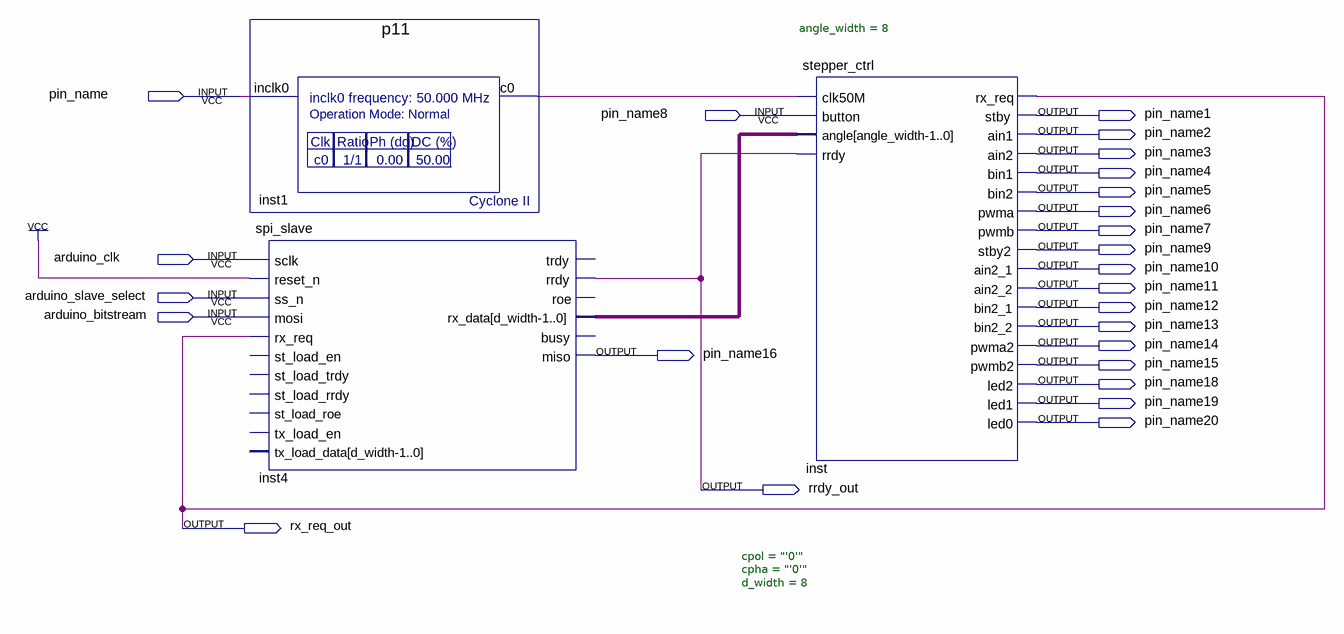
[diagram p0: schematic sheet]
// Quartus schematic step.bdf as structural Verilog: 3 symbols, 25 pins
module step (
  input  pin_name,
  input  pin_name8,
  input  arduino_clk,
  input  arduino_slave_select,
  input  arduino_bitstream,
  output pin_name1,
  output pin_name2,
  output pin_name3,
  output pin_name4,
  output pin_name5,
  output pin_name6,
  output pin_name7,
  output pin_name9,
  output pin_name10,
  output pin_name11,
  output pin_name12,
  output pin_name13,
  output pin_name14,
  output pin_name16,
  output pin_name15,
  output pin_name18,
  output pin_name19,
  output pin_name20,
  output rrdy_out,
  output rx_req_out
);

  wire inst1_c0;
  wire [7:0] inst4_rx_data;

  p11 inst1 (.inclk0(pin_name), .c0(inst1_c0));
  spi_slave #(.cpol("'0'"), .cpha("'0'"), .d_width(8)) inst4 (
    .sclk(arduino_clk), .reset_n(1'b1), .ss_n(arduino_slave_select), .mosi(arduino_bitstream),
    .rx_req(rx_req_out), .rrdy(rrdy_out), .rx_data(inst4_rx_data), .miso(pin_name16));  // open: st_load_en, st_load_trdy, st_load_rrdy, st_load_roe, tx_load_en, tx_load_data, trdy, roe, busy
  stepper_ctrl #(.angle_width(8)) inst (
    .clk50M(inst1_c0), .button(pin_name8), .angle(inst4_rx_data), .rrdy(rrdy_out), .rx_req(rx_req_out),
    .stby(pin_name1), .ain1(pin_name2), .ain2(pin_name3), .bin1(pin_name4), .bin2(pin_name5),
    .pwma(pin_name6), .pwmb(pin_name7), .stby2(pin_name9), .ain2_1(pin_name10), .ain2_2(pin_name11),
    .bin2_1(pin_name12), .bin2_2(pin_name13), .pwma2(pin_name14), .pwmb2(pin_name15), .led2(pin_name18),
    .led1(pin_name19), .led0(pin_name20));
endmodule
